# EAGLE schematic finalprojectshematic (EAGLE 9.6.2)
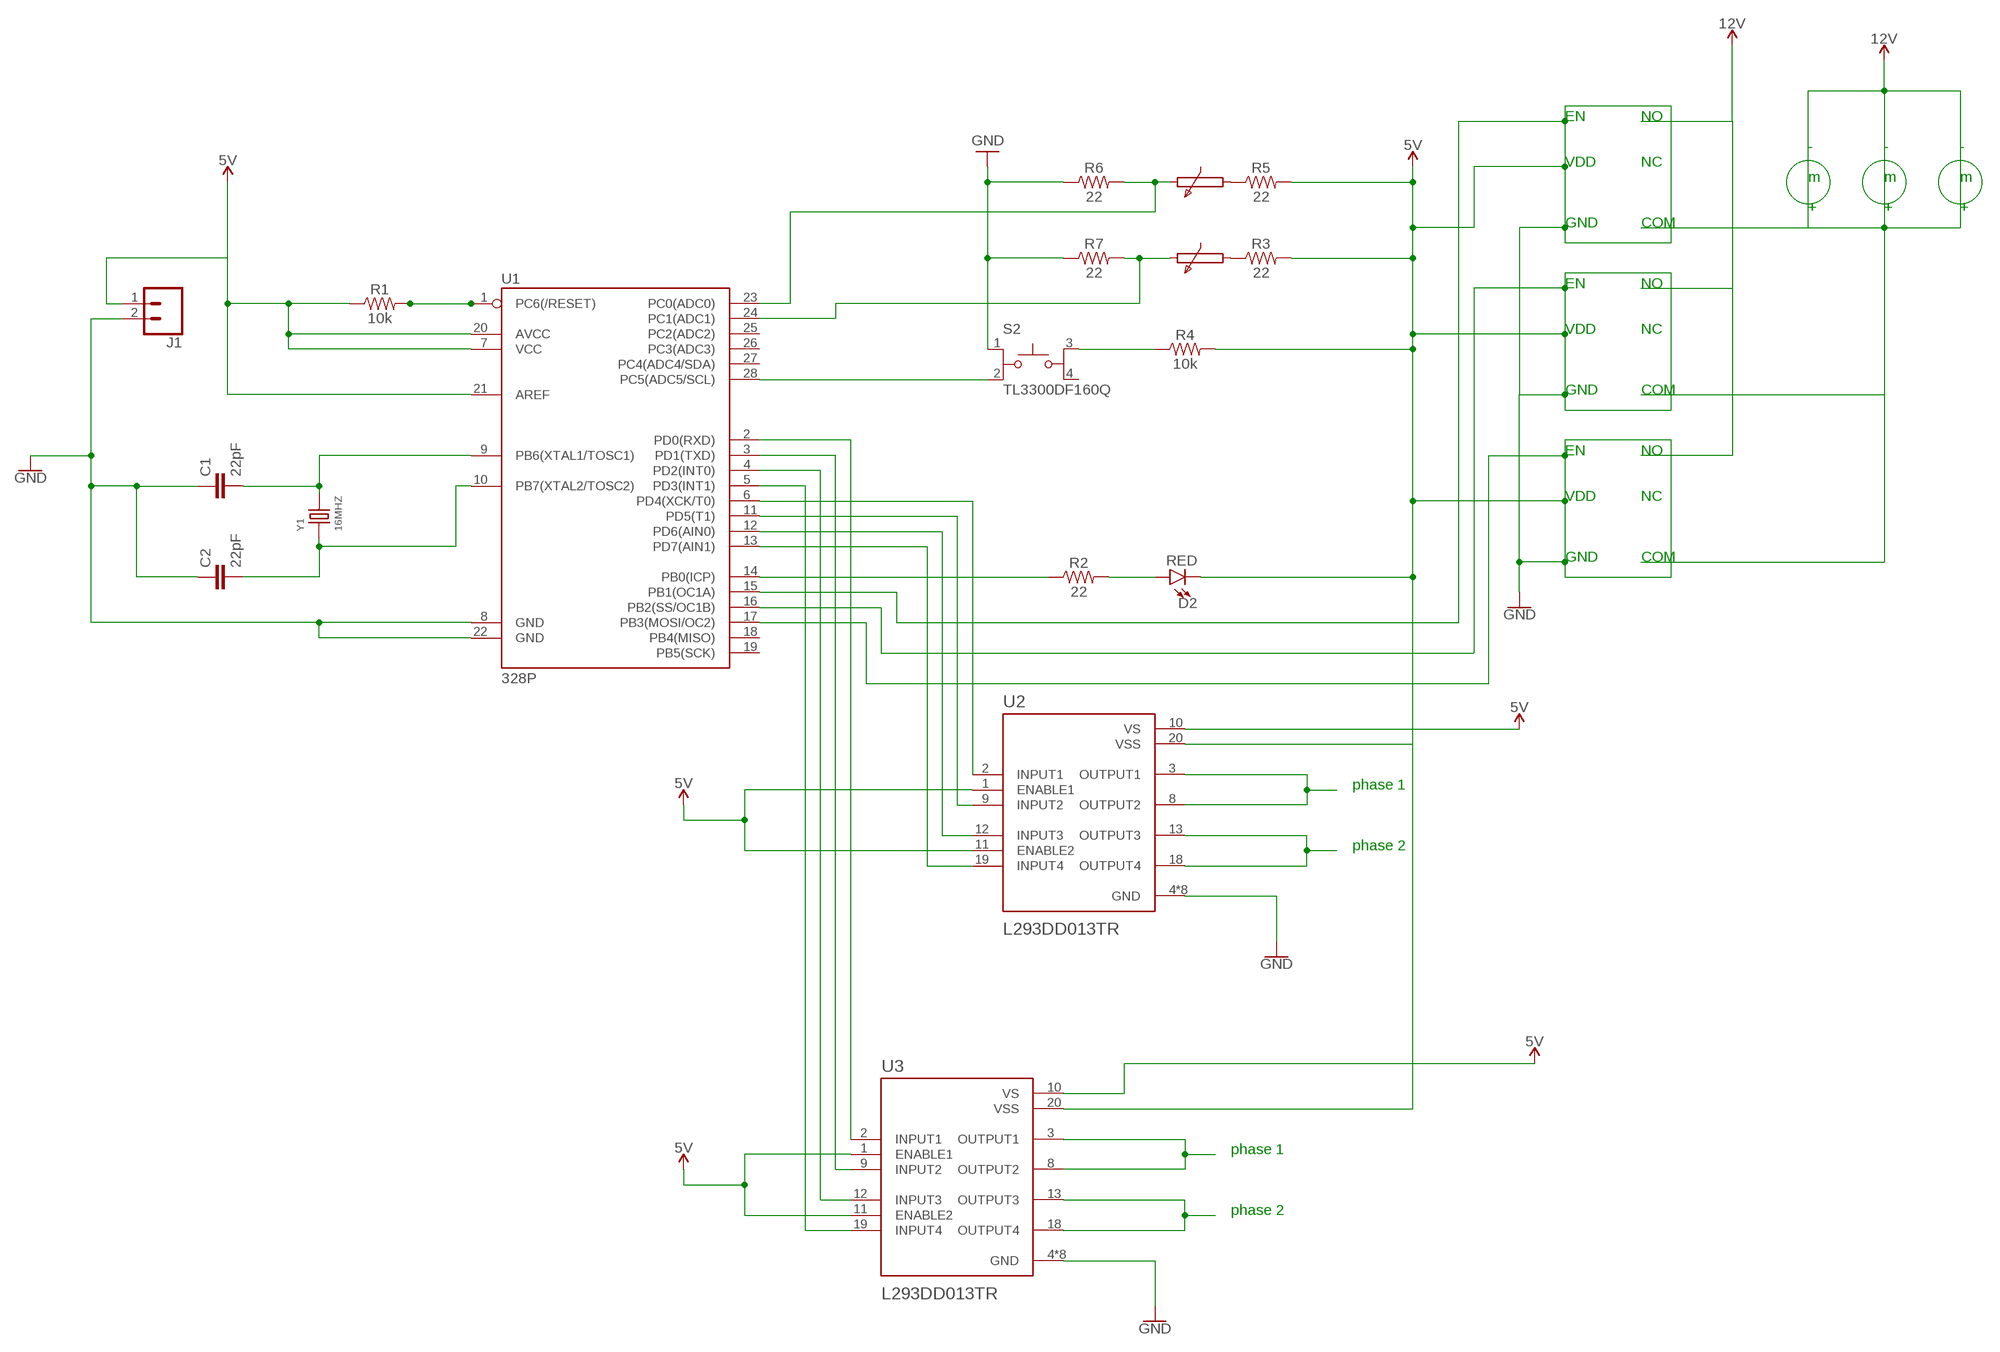
[diagram p0: schematic, sheet 1]

## Parts
C1  22pF  22PF-0603-50V-5%  [0603]
C2  22pF  22PF-0603-50V-5%  [0603]
D2  RED  LED-RED0603  [LED-0603]
J1  CONN_02  [1X02]
R1  10k  10KOHM-HORIZ-1/4W-1%  [AXIAL-0.3]
R2  22  22OHM-0402-1/10W-1%  [0402]
R3  22  22OHM-0402-1/10W-1%  [0402]
R4  10k  10KOHM-0603-1/10W-1%  [0603]
R5  22  22OHM-0402-1/10W-1%  [0402]
R6  22  22OHM-0402-1/10W-1%  [0402]
R7  22  22OHM-0402-1/10W-1%  [0402]
S2  TL3300DF160Q  [SW_TL3300DF160Q]
U1  328P  ATMEGA328P_PDIP  [DIP28]
U2  L293DD013TR  [SOIC127P1032X265-20N]
U3  L293DD013TR  [SOIC127P1032X265-20N]
Y1  16MHZ  DIP-CRYSTAL-16MHZ-18PF-30PPM-40R(HC49US)  [HC49US]

## Nets
5V: J1.1 R1.P$1 U1.7(VCC) U1.20(AVCC) U1.21(AREF) U2.1(ENABLE1) U2.10(VS) U2.11(ENABLE2) U3.1(ENABLE1) U3.10(VS) U3.11(ENABLE2)
GND: C1.1 C2.1 D2.C J1.2 R3.2 R4.2 R5.2 R6.1 R7.1 S2.1 U1.8(GND) U1.15(PB1(OC1A)) U1.16(PB2(SS/OC1B)) U1.17(PB3(MOSI/OC2)) U1.22(GND) U2.4(GND) U2.5(GND) U2.6(GND) U2.7(GND) U2.14(GND) U2.15(GND) U2.16(GND) U2.17(GND) U2.20(VSS) U3.4(GND) U3.5(GND) U3.6(GND) U3.7(GND) U3.14(GND) U3.15(GND) U3.16(GND) U3.17(GND) U3.20(VSS) ; supply symbol labelled 5V
N$1: R1.P$2 U1.1(PC6(/RESET))
N$2: R4.1 S2.3
N$3: C1.2 U1.9(PB6(XTAL1/TOSC1)) Y1.2
N$4: R6.2 U1.23(PC0(ADC0))
N$5: R7.2 U1.24(PC1(ADC1))
N$6: C2.2 U1.10(PB7(XTAL2/TOSC2)) Y1.1
N$8: U1.6(PD4(XCK/T0)) U2.2(INPUT1)
N$9: U1.11(PD5(T1)) U2.9(INPUT2)
N$10: U1.12(PD6(AIN0)) U2.12(INPUT3)
N$11: U1.13(PD7(AIN1)) U2.19(INPUT4)
N$13: D2.A R2.2
N$14: U1.2(PD0(RXD)) U3.2(INPUT1)
N$15: U2.3(OUTPUT1) U2.8(OUTPUT2)
N$16: U1.3(PD1(TXD)) U3.9(INPUT2)
N$17: U1.4(PD2(INT0)) U3.12(INPUT3)
N$18: U2.13(OUTPUT3) U2.18(OUTPUT4)
N$19: U1.5(PD3(INT1)) U3.19(INPUT4)
N$20: U3.3(OUTPUT1) U3.8(OUTPUT2)
N$21: U3.13(OUTPUT3) U3.18(OUTPUT4)
N$22: S2.2 U1.28(PC5(ADC5/SCL))
N$23: R2.1 U1.14(PB0(ICP))
Unconnected: R3.1 R5.1 S2.4 U1.18(PB4(MISO)) U1.19(PB5(SCK)) U1.25(PC2(ADC2)) U1.26(PC3(ADC3)) U1.27(PC4(ADC4/SDA))

## Notes on the sheet
- EN | NO
- - | - | -
- VDD | NC
- m | m | m
- + | + | +
- GND | COM
- EN | NO
- VDD | NC
- GND | COM
- EN | NO
- VDD | NC
- GND | COM
- phase 1
- phase 2
- phase 1
- phase 2

## Library data of the parts
C1 C2 = SparkFun-Capacitors:22PF: 22pF ceramic capacitors A capacitor is a passive two-terminal electrical component used to store electrical energy temporarily in an electric field.; PROD_ID: CAP-07876
D2 = SparkFun-LED:LED-RED: Red SMD LED Used in manufacturing of most products at SparkFun Packages: 0603 - SMD 0603 package [Product Link] <http://docs.avagotech.com/docs/AV02-0551EN> 0603 SMART - SMD 0603 SMART package ( more efficient and expensive)[Product Link] <http://www.osram-os.com/Graphics/XPic2/00077099_0.pdf> 1206 - SMD1206 package [Product Link] <https://www.sparkfun.com/datasheets/DevTools/LilyPad/Q150OVS4.pdff> SparkFun Products: Pro Mini 328 -5V <https://www.sparkfun.com/products/821> RedBoard <https://www.sparkfun.com/products/12757> IOIO-OTG <https://www.sparkfun.com/products/13613>; PROD_ID: DIO-00819
J1 = SparkFun-Connectors:CONN_02: Multi connection point. Often used as Generic Header-pin footprint for 0.1 inch spaced/style header connections On any of the 0.1 inch spaced packages, you can populate with these: Break Away Headers - Straight <https://www.sparkfun.com/products/116> (PRT-00116) Break Away Male Headers - Right Angle <https://www.sparkfun.com/products/553> (PRT-00553) Female Headers <https://www.sparkfun.com/products/115> (PRT-00115) Break Away Headers - Machine Pin <https://www.sparkfun.com/products/117> (PRT-00117) Break Away Female Headers - Swiss Machine Pin <https://www.sparkfun.com/products/743> (PRT-00743) For SCREWTERMINALS and SPRING TERMINALS visit here: Screw Terimnals on SparkFun.com <https://www.sparkfun.com/search/results?term=Screw+Terminals> (5mm/3.5mm/2.54mm spacing) This device is also useful as a general connection point to wire up your design to another part of your project. Our various solder wires solder well into these plated through hole pads. Hook-Up Wire - Assortment (Stranded, 22 AWG) <https://www.sparkfun.com/products/11375> (PRT-11375) Hook-Up Wire - Assortment (Solid Core, 22 AWG) <https://www.sparkfun.com/products/11367> (PRT-11367) View the entire wire category on our website here <https://www.sparkfun.com/categories/141> Special notes: Molex polarized connector foot print use with: PRT-08233 with associated crimp pins and housings. 2.54_SCREWTERM for use with PRT-10571. 3.5mm Screw Terminal footprints for PRT-08084 5mm Screw Terminal footprints for use with PRT-08432
R1 = SparkFun-Resistors:10KOHM: 10kΩ resistor A resistor is a passive two-terminal electrical component that implements electrical resistance as a circuit element. Resistors act to reduce current flow, and, at the same time, act to lower voltage levels within circuits. - Wikipedia; PROD_ID: RES-12183
R2 R3 R5-R7 = SparkFun-Resistors:22OHM: 22Ω resistor A resistor is a passive two-terminal electrical component that implements electrical resistance as a circuit element. Resistors act to reduce current flow, and, at the same time, act to lower voltage levels within circuits. - Wikipedia; PROD_ID: RES-12427
R4 = SparkFun-Resistors:10KOHM: 10kΩ resistor A resistor is a passive two-terminal electrical component that implements electrical resistance as a circuit element. Resistors act to reduce current flow, and, at the same time, act to lower voltage levels within circuits. - Wikipedia; PROD_ID: RES-00824
S2 = TL3300DF160Q:TL3300DF160Q: Check availability <https://pricing.snapeda.com/parts/TL3300DF160Q/E-Switch/view-part?ref=eda>; AVAILABILITY: In Stock; DESCRIPTION: SWITCH TACTILE SPST-NO 0.05A 12V; MF: E-Switch; MP: TL3300DF160Q; PACKAGE: None; PRICE: None; PURCHASE-URL: https://pricing.snapeda.com/search?q=TL3300DF160Q&ref=eda
U1 = SparkFun-IC-Microcontroller:ATMEGA328P_PDIP: Atmel 328P Through hole ATMEGA328P uC used in the Arduino 32kb flash, 1k EEPROM, 2k SRAM Datasheet <http://www.sparkfun.com/datasheets/Components/SMD/ATMega328.pdf> SparkFun Products Storefront component: AVR 28 Pin 20MHz 32K 6A/D - ATMega328P <https://www.sparkfun.com/products/9061> (COM-09061) SparkFun Simon Says - Through-Hole Soldering Kit <https://www.sparkfun.com/products/10547> (KIT-10547) SparkFun Learn to Solder - Simon Says <https://www.sparkfun.com/products/13708> (KIT-13708) SparkFun BigTime Watch Kit <https://www.sparkfun.com/products/11734> (KIT-11734) SparkFun ClockIt <https://www.sparkfun.com/products/10930> (KIT-10930) SparkFun Serial Enabled LCD Kit <https://www.sparkfun.com/products/10097> (LCD-10097) SparkFun Simon Tilts - Through Hole Soldering Kit <https://www.sparkfun.com/products/12634> (KIT-12634) SparkFun Frequency Counter Kit <https://www.sparkfun.com/products/10140> (KIT-10140) FabFM Radio Kit <https://www.sparkfun.com/products/11043> (KIT-11043) SparkFun Binary Blaster Kit <https://www.sparkfun.com/products/12037> (KIT-12037) SparkFun Metro-Gnome <https://www.sparkfun.com/products/9236> (KIT-09236) ATmega328 with Arduino Optiboot (Uno) <https://www.sparkfun.com/products/10524> (DEV-10524); PROD_ID: IC-09136
U2 U3 = L293DD013TR:L293DD013TR: None Check availability <https://pricing.snapeda.com/parts/L293DD013TR/STMicroelectronics/view-part?ref=eda>; AVAILABILITY: In Stock; DESCRIPTION: Bipolar Motor Driver Parallel 20-SOIC; MF: STMicroelectronics; MP: L293DD013TR; PACKAGE: SOIC-20 STMicroelectronics; PRICE: None; PURCHASE-URL: https://pricing.snapeda.com/search?q=L293DD013TR&ref=eda
Y1 = OPL_Crystal Oscillator:DIP-CRYSTAL-16MHZ-18PF-30PPM-40R(HC49US): 306010014; MPN: HC-49US 16.000MHz